# EAGLE design mainboard (EAGLE 7.2.0)
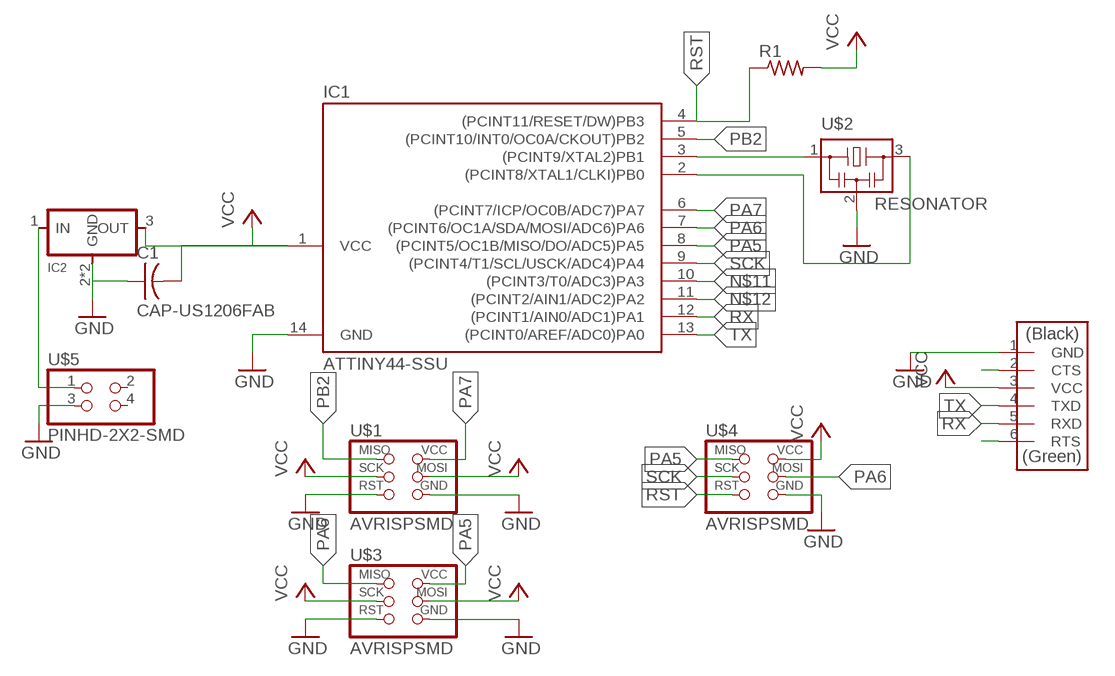
[diagram p0: schematic, sheet 1]

## Parts
C1  CAP-US1206FAB  [C1206FAB]
IC1  ATTINY44-SSU  [SOIC14]
IC2  REGULATORSOT223  [SOT223]
R1  RES-US1206FAB  [R1206FAB]
U$1  AVRISPSMD  [2X03SMD]
U$2  RESONATOR  [EFOBM]
U$3  AVRISPSMD  [2X03SMD]
U$4  AVRISPSMD  [2X03SMD]
U$5  PINHD-2X2-SMD  [2X02SMD]
U$6  FTDI-SMD-HEADER  [1X06SMD]

## Nets
GND: C1.1 IC1.14(GND) IC2.2(GND) IC2.4(GND) U$1.5(RST) U$1.6(GND) U$2.2 U$3.5(RST) U$3.6(GND) U$4.6(GND) U$5.3 U$6.1(GND)
N$1: IC2.1(IN) U$5.1
N$2: IC1.3((PCINT9/XTAL2)PB1) U$2.1
N$11: IC1.10((PCINT3/T0/ADC3)PA3)
N$12: IC1.11((PCINT2/AIN1/ADC2)PA2)
N$16: U$6.2(CTS)
N$20: U$6.6(RTS)
PA5: IC1.8((PCINT5/OC1B/MISO/DO/ADC5)PA5) U$3.2(VCC) U$4.1(MISO)
PA6: IC1.7((PCINT6/OC1A/SDA/MOSI/ADC6)PA6) U$3.1(MISO) U$4.4(MOSI)
PA7: IC1.6((PCINT7/ICP/OC0B/ADC7)PA7) U$1.2(VCC)
PA': IC1.2((PCINT8/XTAL1/CLKI)PB0) U$2.3
PB2: IC1.5((PCINT10/INT0/OC0A/CKOUT)PB2) U$1.1(MISO)
RST: IC1.4((PCINT11/RESET/DW)PB3) R1.1 U$4.5(RST)
RX: IC1.12((PCINT1/AIN0/ADC1)PA1) U$6.5(RXD)
SCK: IC1.9((PCINT4/T1/SCL/USCK/ADC4)PA4) U$4.3(SCK)
TX: IC1.13((PCINT0/AREF/ADC0)PA0) U$6.4(TXD)
VCC: C1.2 IC1.1(VCC) IC2.3(OUT) R1.2 U$1.3(SCK) U$1.4(MOSI) U$3.3(SCK) U$3.4(MOSI) U$4.2(VCC) U$6.3(VCC)
Unconnected: U$5.2 U$5.4

## Library data of the parts
C1 = fab:CAP-US
IC1 = fab:ATTINY44
IC2 = fab:REGULATOR
R1 = fab:RES-US: Resistor (US Symbol) Variants with postfix FAB are widened to allow the routing of internal traces
U$1 U$3 U$4 = fab:AVRISP
U$2 = fab:RESONATOR
U$5 = fab:PINHD-2X2-SMD
U$6 = fab:FTDI-SMD-HEADER

## Board
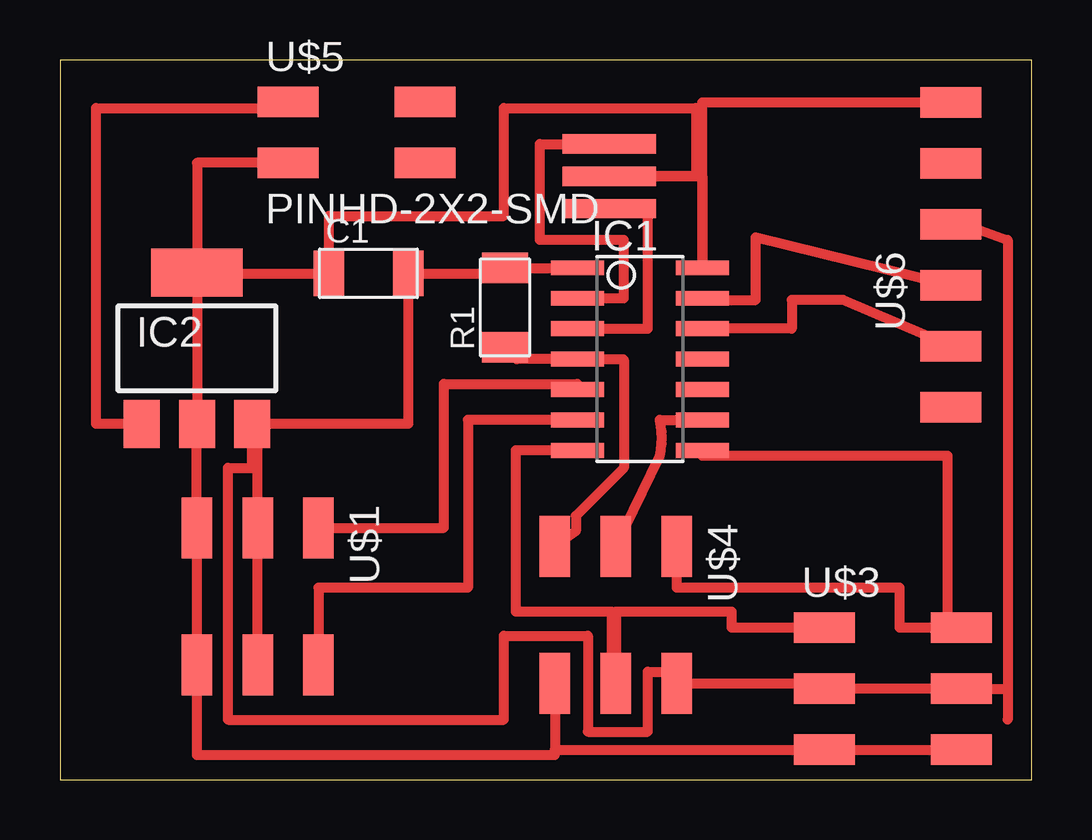
[diagram p1: board, top side]

Size 40.5 x 30 mm. Coordinates in mm from the lower left corner, seen from the top.
Outline: 0,0 40.5,0 40.5,30 0,30 0,0
Copper layers (1*16): Top 0.035mm / dielectric 1.5mm / Bottom 0.035mm
Design rules "default": minimum track width 10mil, minimum drill 24mil, track to track 8mil, track to pad 8mil, pad to pad 8mil, via to via 8mil, smd to smd 8mil, copper to edge 40mil, drill to drill 8mil, minimum pad ring 10mil, minimum via ring 8mil, stop-mask expansion 4mil, vias tented up to drill 0mil, thermal gap 10mil

### Footprints (pad centres in the part's own frame; a part is rotated, then mirrored left to right if it is on the bottom)
C1206FAB = smd 1.27 x 1.905: 1 -1.651,0; 2 1.651,0
SOIC14 = smd 0.61 x 2.21: 1 -3.81,-2.603; 2 -2.54,-2.603; 3 -1.27,-2.603; 4 0,-2.603; 5 1.27,-2.603; 6 2.54,-2.603; 7 3.81,-2.603; 8 3.81,2.603; 9 2.54,2.603; 10 1.27,2.603; 11 0,2.603; 12 -1.27,2.603; 13 -2.54,2.603; 14 -3.81,2.603
SOT223 = smd 1.5 x 2: 1 -2.3,-3.15; 2 0,-3.15; 3 2.3,-3.15 | smd 3.8 x 2: 4 0,3.15
R1206FAB = smd 1.27 x 1.905: 1 -1.651,0; 2 1.651,0
2X03SMD = smd 2.54 x 1.27: 1 -2.857,2.54; 2 2.857,2.54; 3 -2.857,0; 4 2.857,0; 5 -2.857,-2.54; 6 2.857,-2.54
EFOBM = smd 0.8 x 3.9: 1 -1.35,0; 2 0,0; 3 1.35,0
2X02SMD = smd 2.54 x 1.27: 1 -2.857,1.27; 2 2.857,1.27; 3 -2.857,-1.27; 4 2.857,-1.27
1X06SMD = smd 2.54 x 1.27: 1 0,6.35; 2 0,3.81; 3 0,1.27; 4 0,-1.27; 5 0,-3.81; 6 0,-6.35

### Placement (x,y rotation side)
C1  12.86,21.1 0 top
IC1  24.17,17.53 270 top
IC2  5.71,17.98 0 top
R1  18.55,19.68 90 top
U$1  8.24,7.64 270 top
U$2  22.9,25.15 90 top
U$3  34.72,3.79 0 top
U$4  23.17,6.87 270 top
U$5  12.37,26.98 0 top
U$6  37.14,21.88 0 top

### Tracks (layer width: path | path; a pad name or v marks a point on that pad's centre or on a via)
GND
  Top 0.406: 5.71,21.1 IC2.4 5.71,25.71 U$5.3 | 5.71,21.1 C1.1 11.21,23.5 18.5,23.5 18.5,28 26.5,28 26.5,25.15 U$2.2 26.77,25.15 IC1.14 26.77,28.23 U$6.1 | 5.71,21.1 IC2.2 U$1.5 U$1.6 5.7,1.01 20.63,1.01 20.63,1.25 | U$3.6 U$3.5 20.63,1.25 | U$4.6 20.63,1.25
N$1
  Top 0.406: IC2.1 1.5,14.83 1.5,28 8.51,28 U$5.1
N$2
  Top 0.406: IC1.3 24.5,18.8 24.5,24 22.9,24 U$2.1
PA5
  Top 0.406: U$4.1 25.71,8 35,8 35,6.33 U$3.2 37,6.33 37,13.5 26.77,13.5 IC1.8
PA6
  Top 0.406: IC1.7 19,13.72 19,7 23,7 23,4.01 U$4.4 23.17,7 28,7 28,6.33 U$3.1
PA7
  Top 0.406: IC1.6 17,14.99 17,8 10.78,8 U$1.2
PA'
  Top 0.406: IC1.2 23.5,20.07 23.5,22.5 20,22.5 20,26.5 U$2.3
PB2
  Top 0.406: U$1.1 16,10.5 16,16.5 21.57,16.5 IC1.5
RST
  Top 0.406: U$4.5 21.5,10.36 21.5,11 23.5,13 23.5,17.5 23.47,17.53 IC1.4 19.05,17.53 R1.1
RX
  Top 0.406: U$6.5 32.64,20 30.5,20 30.5,18.8 IC1.12
SCK
  Top 0.406: U$4.3 25,13.5 arc28 25,15 IC1.9
TX
  Top 0.406: IC1.13 26.77,20 29,20 29,22.61 U$6.4
VCC
  Top 0.406: IC1.1 21.56,21.33 R1.2 18.55,21.1 C1.2 14.51,14.83 8.24,14.83 | 8.24,14.83 IC2.3 | U$6.3 38.14,23 39.5,22.5 39.5,3.79 | 39.5,3.79 39.5,2.5 | IC2.3 8,13 7,13 7,2.5 18.5,2.5 18.5,6 22,6 22,2 24.5,2 24.5,4.5 25.71,4.5 U$4.2 | 8,15.5 IC2.3 | U$1.4 U$1.3 8.24,14.83 | 39.5,3.79 U$3.4 U$3.3 31.86,4.01 U$4.2 | U$4.2 25.5,3.51